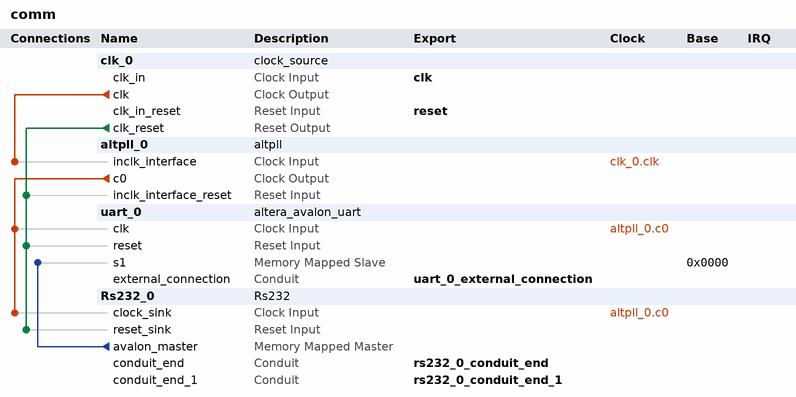
[diagram p0: system contents]
# Platform Designer (Qsys) system comm, Cyclone IV E EP4CE115F29C7
# Parameters at their usual value, and those the tool derives, are not listed.
package require -exact qsys 15.1
create_system comm
set_project_property DEVICE_FAMILY {Cyclone IV E}
set_project_property DEVICE EP4CE115F29C7

add_instance clk_0 clock_source 15.1
set_instance_parameter_value clk_0 clockFrequency 50000000

add_instance altpll_0 altpll 15.1
set_instance_parameter_value altpll_0 CLK0_DIVIDE_BY 2
set_instance_parameter_value altpll_0 CLK0_MULTIPLY_BY 1
set_instance_parameter_value altpll_0 INCLK0_INPUT_FREQUENCY 20000
set_instance_parameter_value altpll_0 PORT_ARESET PORT_USED
set_instance_parameter_value altpll_0 PORT_LOCKED PORT_USED
set_instance_parameter_value altpll_0 PORT_clk1 PORT_UNUSED
set_instance_parameter_value altpll_0 PORT_clk2 PORT_UNUSED
set_instance_parameter_value altpll_0 PORT_clk3 PORT_UNUSED

add_instance uart_0 altera_avalon_uart 15.1
set_instance_parameter_value uart_0 baud 4800
set_instance_parameter_value uart_0 dataBits 8
set_instance_parameter_value uart_0 fixedBaud true
set_instance_parameter_value uart_0 parity NONE
set_instance_parameter_value uart_0 stopBits 1

add_instance Rs232_0 Rs232 1.0
set_instance_parameter_value Rs232_0 S_END 5
set_instance_parameter_value Rs232_0 S_GET_READ_STATUS 1
set_instance_parameter_value Rs232_0 S_GET_WRITE_STATUS 2
set_instance_parameter_value Rs232_0 S_IDLE 0
set_instance_parameter_value Rs232_0 S_RECV 3
set_instance_parameter_value Rs232_0 S_SEND 4

# connections
add_connection altpll_0.c0 Rs232_0.clock_sink clock
add_connection altpll_0.c0 uart_0.clk clock
add_connection clk_0.clk altpll_0.inclk_interface clock
add_connection clk_0.clk_reset altpll_0.inclk_interface_reset reset
add_connection clk_0.clk_reset Rs232_0.reset_sink reset
add_connection clk_0.clk_reset uart_0.reset reset
add_connection Rs232_0.avalon_master uart_0.s1 avalon
set_connection_parameter_value Rs232_0.avalon_master/uart_0.s1 baseAddress 0x0000

# exported interfaces
add_interface clk clock sink
set_interface_property clk EXPORT_OF clk_0.clk_in
add_interface reset reset sink
set_interface_property reset EXPORT_OF clk_0.clk_in_reset
add_interface rs232_0_conduit_end conduit end
set_interface_property rs232_0_conduit_end EXPORT_OF Rs232_0.conduit_end
add_interface rs232_0_conduit_end_1 conduit end
set_interface_property rs232_0_conduit_end_1 EXPORT_OF Rs232_0.conduit_end_1
add_interface uart_0_external_connection conduit end
set_interface_property uart_0_external_connection EXPORT_OF uart_0.external_connection

set_interconnect_requirement {$system} qsys_mm.clockCrossingAdapter HANDSHAKE
set_interconnect_requirement {$system} qsys_mm.enableEccProtection FALSE
set_interconnect_requirement {$system} qsys_mm.insertDefaultSlave FALSE
set_interconnect_requirement {$system} qsys_mm.maxAdditionalLatency 1

save_system comm.qsys
